# Altium schematic sheet I2C_GPIO_Expansion.SchDoc
size A4 portrait
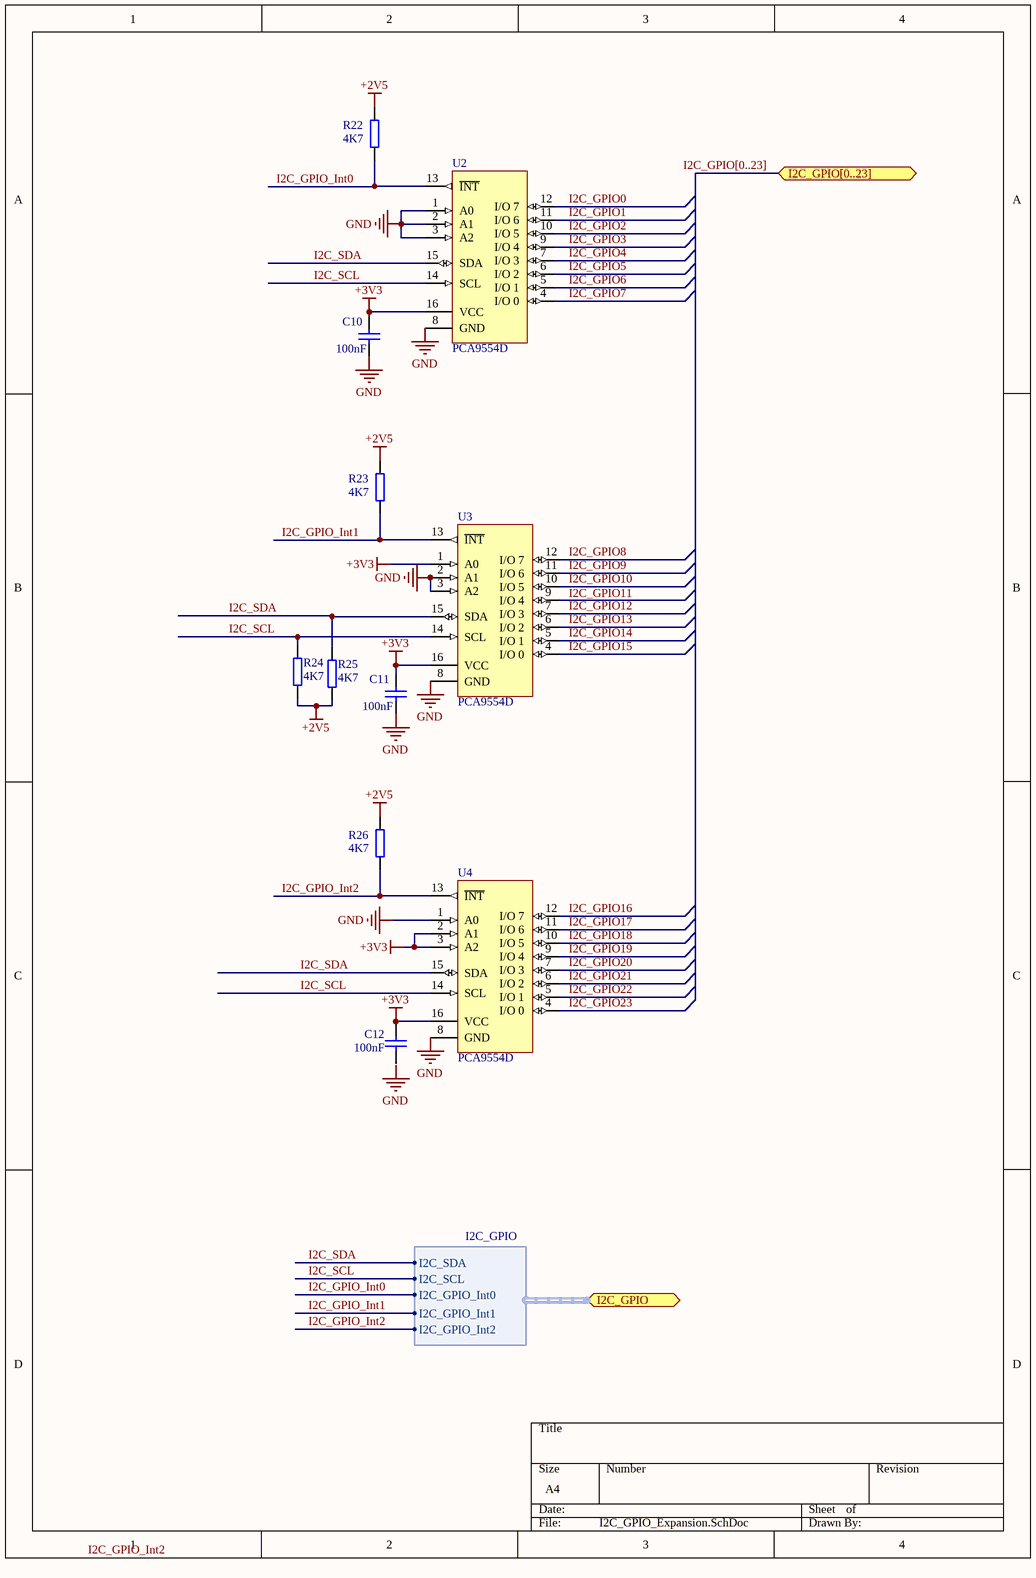
[diagram p0: I2C_GPIO_Expansion.SchDoc]

## Parts
C10  100nF  [CC1608-0603]
C11  100nF  [CC1608-0603]
C12  100nF  [CC1608-0603]
R22  4K7  [0603]
R23  4K7  [0603]
R24  4K7  [0603]
R25  4K7  [0603]
R26  4K7  [0603]
U2  PCA9554D  [SOP65P640X110-20N]
U3  PCA9554D  [SOP65P640X110-20N]
U4  PCA9554D  [SOP65P640X110-20N]

## Ports
I2C_GPIO (harness I2C_GPIO), I2C_GPIO[0..23] (bidir)

## Harnesses
I2C_GPIO: I2C_GPIO_Int0, I2C_SDA, I2C_SCL, I2C_GPIO_Int1, I2C_GPIO_Int2

## Nets
+2V5: R22.2 R23.2 R24.1 R25.1 R26.2
+3V3: C10.2 C11.2 C12.1 U2.16(VCC) U3.1(A0) U3.16(VCC) U4.2(A1) U4.3(A2) U4.16(VCC)
GND: C10.1 C11.1 U2.1(A0) U2.2(A1) U2.3(A2) U2.8(GND) U3.2(A1) U3.3(A2) U3.8(GND) U4.1(A0) U4.8(GND)
I2C_GPIO0: U2.12(I/O_7)
I2C_GPIO1: U2.11(I/O_6)
I2C_GPIO2: U2.10(I/O_5)
I2C_GPIO3: U2.9(I/O_4)
I2C_GPIO4: U2.7(I/O_3)
I2C_GPIO5: U2.6(I/O_2)
I2C_GPIO6: U2.5(I/O_1)
I2C_GPIO7: U2.4(I/O_0)
I2C_GPIO8: U3.12(I/O_7)
I2C_GPIO9: U3.11(I/O_6)
I2C_GPIO10: U3.10(I/O_5)
I2C_GPIO12: U3.7(I/O_3)
I2C_GPIO13: U3.6(I/O_2)
I2C_GPIO14: U3.5(I/O_1)
I2C_GPIO15: U3.4(I/O_0)
I2C_GPIO16: U4.12(I/O_7)
I2C_GPIO17: U4.11(I/O_6)
I2C_GPIO18: U4.10(I/O_5)
I2C_GPIO19: U4.9(I/O_4)
I2C_GPIO20: U4.7(I/O_3)
I2C_GPIO21: U4.6(I/O_2)
I2C_GPIO22: U4.5(I/O_1)
I2C_GPIO23: U4.4(I/O_0)
I2C_GPIO_Int0: R22.1 U2.13(~{INT}) ; port I2C_GPIO.I2C_GPIO_Int0
I2C_GPIO_Int1: R23.1 U3.13(~{INT}) ; port I2C_GPIO.I2C_GPIO_Int1
I2C_GPIO_Int2: R26.1 U4.13(~{INT}) ; port I2C_GPIO.I2C_GPIO_Int2
I2C_SCL: R24.2 U2.14(SCL) U3.14(SCL) U4.14(SCL) ; port I2C_GPIO.I2C_SCL
I2C_SDA: R25.2 U2.15(SDA) U3.15(SDA) U4.15(SDA) ; port I2C_GPIO.I2C_SDA

Not connected (* = marked no-connect by the designer): C12 2; U3 9(I/O_4)

## Buses and harness runs
bus I2C_GPIO[0..23]

## Notes on the sheet
- Labels drawn without touching a wire or pin: GND, I2C_GPIO11, I2C_GPIO[0..23], I2C_GPIO_Int2

## Library data of the parts
C10-C12 = CC0603_100NF_16V_10%_X7R: Capacitor; Manufacturer1: AVX; Manufacturer1 PN: 0603YC104KAT2A; TC: X7R; Tolerance: ±10%; Voltage: 16V; Published: 8-Jun-2000; LatestRevisionDate: 17-Jul-2002; LatestRevisionNote: Re-released for DXP Platform.; PackageReference: RAD-0.3; Publisher: Altium Limited; Distributor1: Digikey; Distributor1 PN: 478-1239-1-ND; Case: 0603; Value: 100nF
R22-R26 = R0603_4.7K_±1%_0.1W_100PPM: SMD Resistor; Manufacturer1: Panasonic; Manufacturer1 PN: ERJ-3EKF4701V; TCR: 100ppm; Power Rating: 0.1W; Tolerance: ±1%; Case: 0603; Distributor1: DigiKey; Distributor1 PN: P4.70KHCT-ND; Value: 4K7
U2-U4 = PCA9554D: 8-bit I2C-bus SMBus I/O port with interrupt; Manufacturer1 PN: PCA9554ATS,118; Manufacturer1: NXP Semiconductors; Distributor1: Digikey; Distributor1 PN: 568-2024-1-ND